# EasyEDA Pro project STC15W4K56S4_2025-01-08_21-36-35.eprj, board PCB1
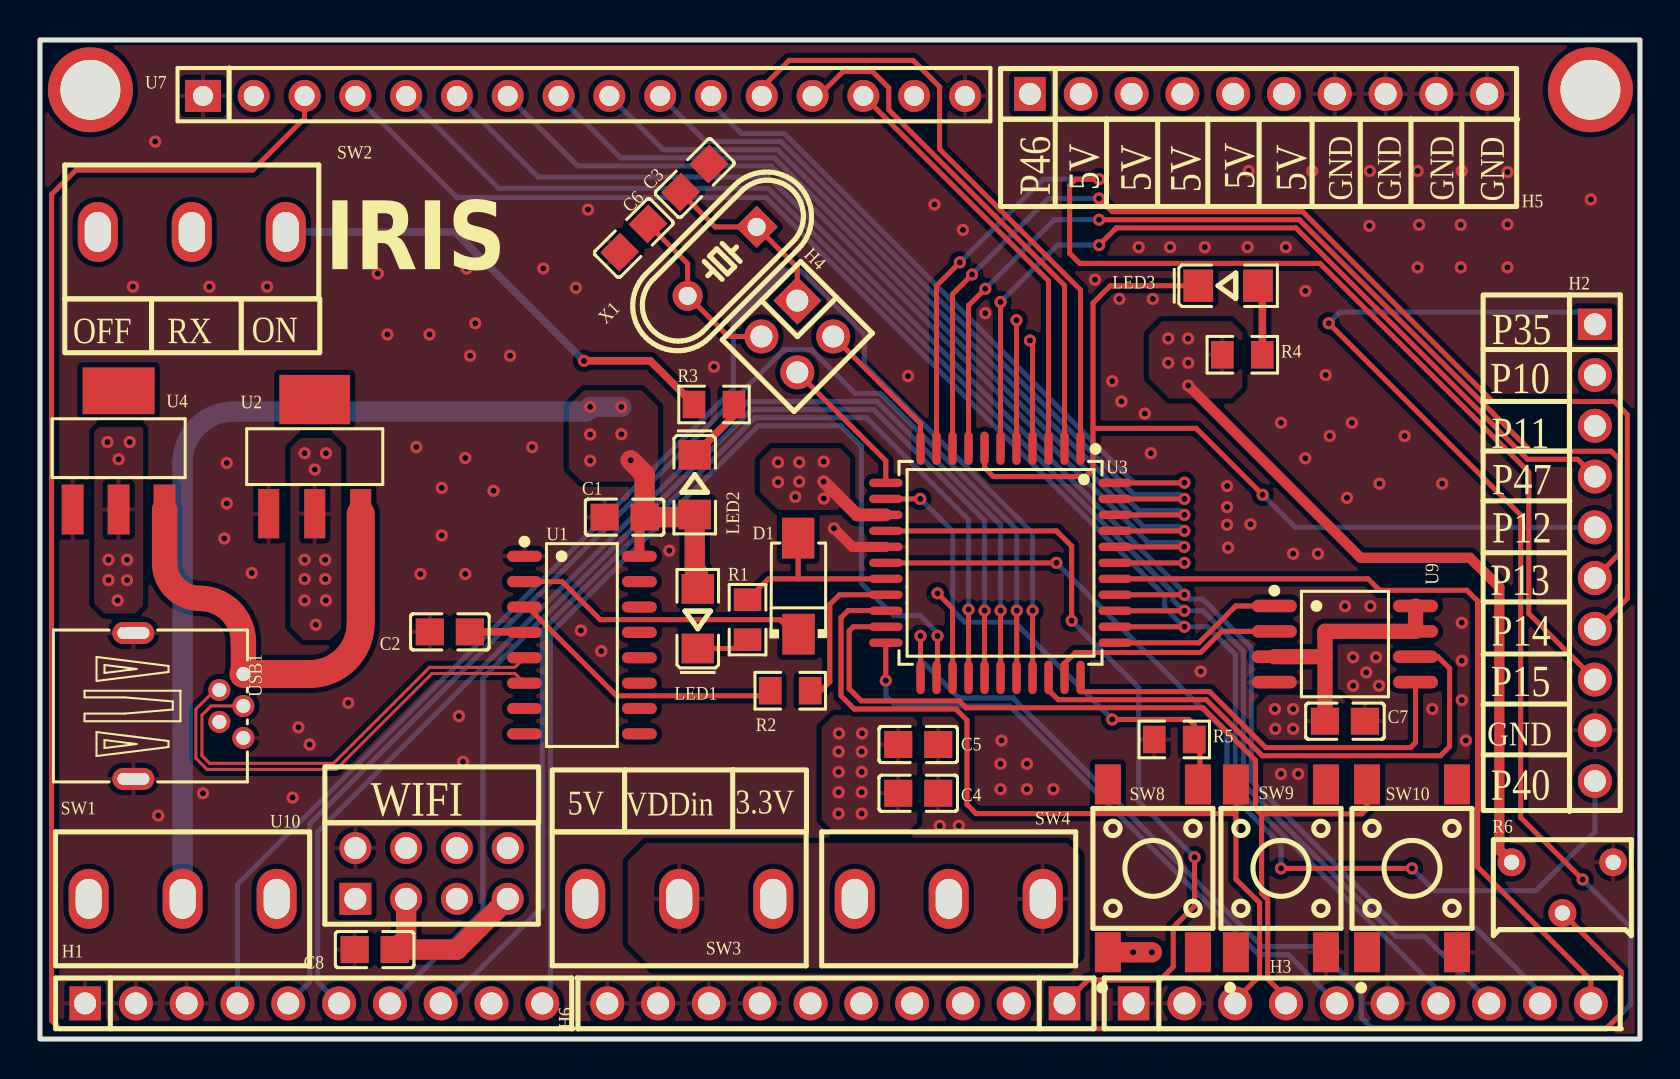
[diagram p2: board, top side]
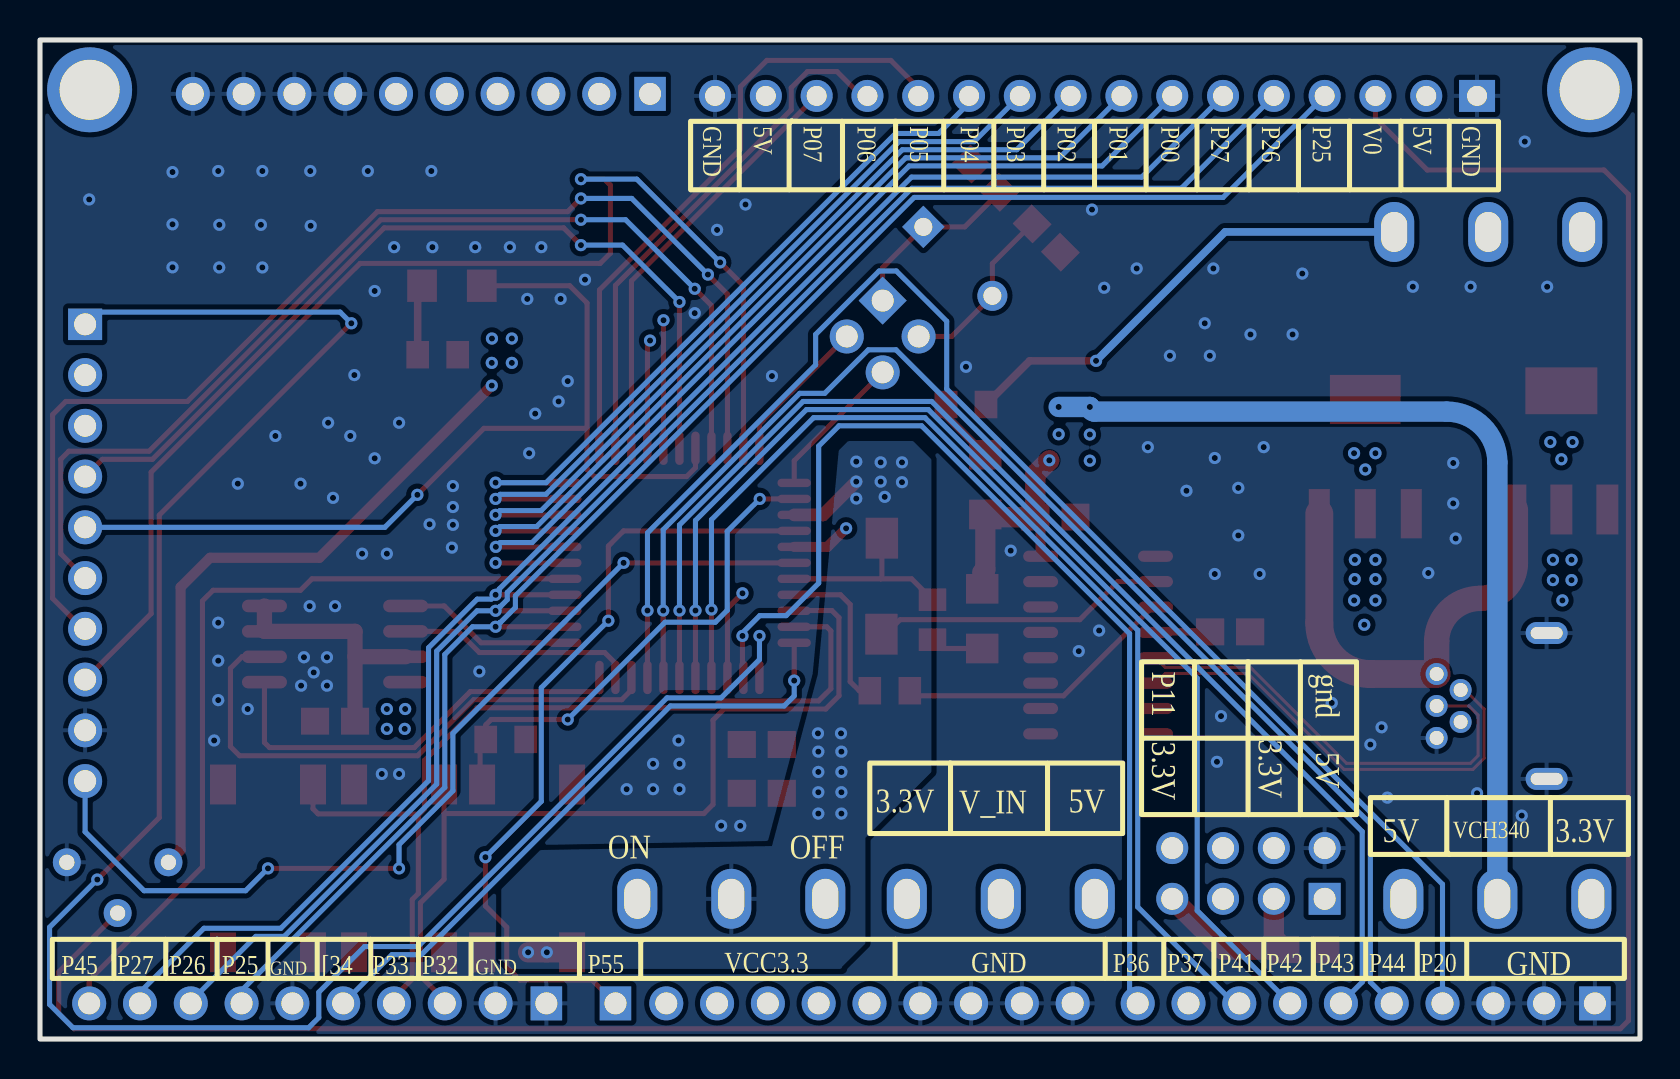
[diagram p3: board, bottom side, seen from below]

Outline 80 x 50 mm; copper layers: Top Layer, 内层2, 内层1, Bottom Layer. Coordinates in mm from the lower left corner of the outline.
Outline path: rectangle 0,50 80,0
Stack: Top Layer 0.035mm 外层铜厚1oz / Dielectric1 0.2104mm 7628 RC49% 8.6mil / 内层2 0.0152mm 内层铜厚 / Dielectric2 1.065mm 1.1mm H/HOZ Copper / 内层1 0.0152mm 内层铜厚 / Dielectric3 0.2104mm 7628 RC49% 8.6mil / Bottom Layer 0.035mm 外层铜厚1oz

## Design rules (mm)
net VCC340: power
net GND: power
net $1N635: signal_power
net VDD: power
net VCC33: power
net VCC5: power
net $1N2603: signal_power
net $1N5908: signal_power
net $1N2614: signal_power
net VCC_IN: power
net VCC: power
template: 自定义配置
spacing copperThickness1oz (default): track to track 0.152, other pairs 0.152 to 0.3
spacing copperThickness2oz: track to track 0.203, other pairs 0.152 to 0.3
track width copperThickness1oz (default): min 0.127, default 0.254, max 2.54
track width copperThickness2oz: min 0.203, default 0.254, max 2.54
track width Power: min 0.508, default 1.016, max 2.54
track width Power_Signal: min 0.254, default 0.381, max 2.54
differential pair differentialPair (default): width min 0.127, default 0.254, max 2.54; gap min 0.152, default 0.152
via viaSize (default): diameter min 0.5, default 0.61, max 10; hole min 0.3, default 0.305, max 6.299
net class power uses Power
net class signal_power uses Power_Signal
net VCC340 uses Power
net GND uses Power
net $1N635 uses Power_Signal
net VDD uses Power
net VCC33 uses Power
net VCC5 uses Power
net $1N2603 uses Power_Signal
net $1N5908 uses Power_Signal
net $1N2614 uses Power_Signal
net VCC_IN uses Power
net VCC uses Power

## Placement (name value [footprint] x y rotation side)
C1  100nF  [C0805]  29.23 26.12 0 top
C2  10nF  [C0805]  20.49 20.38 0 top
C3  30pF  [C0805]  32.74 43.08 225 top
C4  47uF  [C0805]  43.91 12.3 180 top
C5  10nF  [C0805]  43.91 14.74 180 top
C6  30pF  [C0805]  29.69 40.09 225 top
C7  100nF  [C0805]  65.25 15.91 0 top
C8  100nF  [C0805]  16.73 4.48 0 top
D1  SS12  [SMA_L4.3-W2.6-LS5.0-RD]  37.92 22.66 90 top
H1  2.54-1*10  [HDR-TH_10P-P2.54-V-M]  13.69 1.78 0 top
H2  2.54-1*10  [HDR-TH_10P-P2.54-V-M]  77.74 24.34 270 top
H3  2.54-1*10  [HDR-TH_10P-P2.54-V-M]  66.11 1.78 0 top
H4  PZ254V-12-4P  [HDR-TH_4P-P2.54-V-M-R2-C2-S2.54]  37.87 35.16 225 top
H5  2.54-1*10  [HDR-TH_10P-P2.54-V-M]  60.93 47.3 0 top
H6  2.54-1*10  [HDR-TH_10P-P2.54-V-M]  39.8 1.78 180 top
LED1  XL-3216SURC  [LED1206-R-RD_RED]  32.89 21.04 90 top
LED2  XL-3216SURC  [LED1206-R-RD_RED]  32.74 27.74 270 top
LED3  XL-3216SURC  [LED1206-R-RD_RED]  59.41 37.7 0 top
NOREF  -  [Pad_e58]  2.52 47.51 0 top
NOREF#2  -  [Pad_e60]  77.52 47.51 0 top
R1  10kΩ  [R0805]  35.38 20.99 270 top
R2  300Ω  [R0805]  37.51 17.43 180 top
R3  10K  [R0805]  33.7 31.76 0 top
R4  10kΩ  [R0805]  60.12 34.25 180 top
R5  4.7kΩ  [R0805]  56.71 14.99 0 top
R6  10kΩ  [RES-ADJ-TH_3P-L7.1-W6.9-P2.50-BL-BS]  76.12 7.58 0 top
SW1  SS-12D10L5  [SW-TH_SS-12D10L5]  7.13 7.02 0 top
SW2  SS-12D10L5  [SW-TH_SS-12D10L5]  7.59 40.39 180 top
SW3  SS-12D10L5  [SW-TH_SS-12D10L5]  31.96 7.02 0 top
SW4  SS-12D10L5  [SW-TH_SS-12D10L5]  45.44 7.02 0 top
SW8  KH-6X6X6H-STM  [SW-SMD_4P-L6.0-W6.0-P4.50-LS9.0-3]  55.65 8.54 90 top
SW9  KH-6X6X6H-STM  [SW-SMD_4P-L6.0-W6.0-P4.50-LS9.0-3]  62.05 8.54 90 top
SW10  KH-6X6X6H-STM  [SW-SMD_4P-L6.0-W6.0-P4.50-LS9.0-3]  68.6 8.54 90 top
U1  CH340C  [SOP-16_L10.0-W3.9-P1.27-LS6.0-BL]  27.1 19.72 270 top
U2  AMS1117-5.0  [SOT-223_L6.5-W3.5-P2.30-LS7.0-BR]  13.74 29.15 270 top
U3  STC15W4K56S4-30I-LQFP44  [LQFP-44_L10.0-W10.0-P0.80-LS12.0-BL]  48.03 23.83 180 top
U4  AMS1117-3.3  [SOT-223-3_L6.5-W3.4-P2.30-LS7.0-BR]  3.93 29.47 270 top
U7  PM254-1-16-Z-8.5  [HDR-TH_16P-P2.54-V-F-A]  27.2 47.2 0 top
U9  W25Q64JVSSIQ  [SOIC-8_L5.3-W5.3-P1.27-LS8.0-BL]  65.25 19.77 270 top
U10  2.54-2*4  [HDR-TH_8P-P2.54-V-F-R2-C4-S2.54]  19.58 8.29 0 top
USB1  U-M-M5DW-W-1  [MINI-USB-TH_U-M-M5DW-W-1]  7.42 16.67 270 top
X1  24MHz  [HC-49US_L11.5-W4.5-P4.88]  34.11 38.92 225 top

## Footprints (pads in the part's own frame, mm; a bottom-side part is the same pattern mirrored in y, then rotated)
C0805
  rect 1.41x1.35 smd: 1(-1,0) 2(1,0)
HC-49US_L11.5-W4.5-P4.88
  rect 1.5x1.5 hole 0.9: 1(-2.44,0)
  round 1.5 hole 0.9: 2(2.44,0)
HDR-TH_4P-P2.54-V-M-R2-C2-S2.54
  rect 1.7x1.7 hole 1.1: 1(-1.27,-1.27)
  round 1.7 hole 1.1: 2(-1.27,1.27) 3(1.27,-1.27) 4(1.27,1.27)
HDR-TH_8P-P2.54-V-F-R2-C4-S2.54
  rect 1.6x1.6 hole 1.1: 1(-3.81,-1.27)
  round 1.6 hole 1.1: 2(-3.81,1.27) 3(-1.27,-1.27) 4(-1.27,1.27) 5(1.27,-1.27) 6(1.27,1.27) 7(3.81,-1.27) 8(3.81,1.27)
HDR-TH_10P-P2.54-V-M
  rect 1.575x1.7 hole 1.1: 1(-11.43,0)
  round 1.7 hole 1.1: 2(-8.89,0) 3(-6.35,0) 4(-3.81,0) 5(-1.27,0) 6(1.27,0) 7(3.81,0) 8(6.35,0) 9(8.89,0) 10(11.43,0)
HDR-TH_16P-P2.54-V-F-A
  rect 1.8x1.6 hole 1: 1(-19.05,0)
  round 1.6 hole 1: 2(-16.51,0) 3(-13.97,0) 4(-11.43,0) 5(-8.89,0) 6(-6.35,0) 7(-3.81,0) 8(-1.27,0) 9(1.27,0) 10(3.81,0) 11(6.35,0) 12(8.89,0) 13(11.43,0) 14(13.97,0) 15(16.51,0) 16(19.05,0)
LED1206-R-RD_RED
  rect 1.485x1.62 smd: 1(1.492,0) 2(-1.492,0)
LQFP-44_L10.0-W10.0-P0.80-LS12.0-BL
  oval 0.42x1.67 smd: 1(-4,-5.735) 2(-3.2,-5.735) 3(-2.4,-5.735) 4(-1.6,-5.735) 5(-0.8,-5.735) 6(0,-5.735) 7(0.8,-5.735) 8(1.6,-5.735) 9(2.4,-5.735) 10(3.2,-5.735) 11(4,-5.735) 23(4,5.735) 24(3.2,5.735) 25(2.4,5.735) 26(1.6,5.735) 27(0.8,5.735) 28(0,5.735) 29(-0.8,5.735) 30(-1.6,5.735) 31(-2.4,5.735) 32(-3.2,5.735) 33(-4,5.735)
  oval 1.67x0.42 smd: 12(5.735,-4) 13(5.735,-3.2) 14(5.735,-2.4) 15(5.735,-1.6) 16(5.735,-0.8) 17(5.735,0) 18(5.735,0.8) 19(5.735,1.6) 20(5.735,2.4) 21(5.735,3.2) 22(5.735,4) 34(-5.735,4) 35(-5.735,3.2) 36(-5.735,2.4) 37(-5.735,1.6) 38(-5.735,0.8) 39(-5.735,0) 40(-5.735,-0.8) 41(-5.735,-1.6) 42(-5.735,-2.4) 43(-5.735,-3.2) 44(-5.735,-4)
MINI-USB-TH_U-M-M5DW-W-1
  round 1.1 hole 0.7: 1(-1.6,2.75) 2(-0.8,1.55) 3(0,2.75) 4(0.8,1.55) 5(1.6,2.75)
  oval 1.1x2.1 hole 0.6x1.6: 6(-3.65,-2.75) 7(3.65,-2.75)
Pad_e58
  round 4.25 hole 3: 1(0,0)
Pad_e60
  round 4.25 hole 3: 1(0,0)
R0805
  rect 1.133x1.377 smd: 1(-1,0) 2(1,0)
RES-ADJ-TH_3P-L7.1-W6.9-P2.50-BL-BS
  round 1.4 hole 0.762: 1(2.54,1.27) 2(0,-1.27) 3(-2.54,1.27)
SMA_L4.3-W2.6-LS5.0-RD
  rect 2.046x1.62 smd: 1(-2.404,-0.009) 2(2.404,0.009)
SOIC-8_L5.3-W5.3-P1.27-LS8.0-BL
  oval 0.63x2.25 smd: 1(-1.905,-3.53) 2(-0.635,-3.53) 3(0.635,-3.53) 4(1.905,-3.53) 5(1.905,3.53) 6(0.635,3.53) 7(-0.635,3.53) 8(-1.905,3.53)
SOP-16_L10.0-W3.9-P1.27-LS6.0-BL
  oval 0.56x1.745 smd: 1(-4.445,-2.873) 2(-3.175,-2.873) 3(-1.905,-2.873) 4(-0.635,-2.873) 5(0.635,-2.873) 6(1.905,-2.873) 7(3.175,-2.873) 8(4.445,-2.873) 9(4.445,2.873) 10(3.175,2.873) 11(1.905,2.873) 12(0.635,2.873) 13(-0.635,2.873) 14(-1.905,2.873) 15(-3.175,2.873) 16(-4.445,2.873)
SOT-223-3_L6.5-W3.4-P2.30-LS7.0-BR
  rect 2.5x1.1 smd: 1(2.97,-2.3) 2(2.97,0) 3(2.97,2.3)
  rect 2.34x3.6 smd: 4(-2.97,0)
SOT-223_L6.5-W3.5-P2.30-LS7.0-BR
  rect 2.465x1.05 smd: 1(2.857,-2.3) 2(2.857,0) 3(2.857,2.3)
  rect 2.465x3.54 smd: 4(-2.857,0)
SW-SMD_4P-L6.0-W6.0-P4.50-LS9.0-3
  rect 2x1.3 smd: 1(-4.2,2.25) 2(4.2,2.25) 3(-4.2,-2.25) 4(4.2,-2.25)
SW-TH_SS-12D10L5
  oval 2x3 hole 1.3x2: 1(-4.7,0) 2(0,0) 3(4.7,0)

## Nets
As in the schematic.

Pads without a net: NOREF 1; NOREF#2 1; SW2 3; SW4 1; SW8 2 3; SW9 1 4; SW10 1 4; U1 7 8 9 10 11 12 13 14 15; U2 4; U4 4; U10 4 5 6; USB1 4

## Via types
v1: diameter 0.61, hole 0.305, Top Layer to Bottom Layer, 201 vias

## Routing (per net, layer and track width the routed paths; a pad name or vN(x,y) marks a point on that pad's centre or on a via; arc(x,y) is an arc through that point)
GND: length 3
  Top Layer w0.508: 42.29,24.63 40.62,24.63 v1(39.7,25.56)
  vias: v1(4.64,37.65) v1(5.76,44.91) v1(5.91,11.18) v1(8.15,12.3) v1(8.47,37.65) v1(9.22,25.05) v1(9.34,28.83) v1(9.34,26.81) v1(10.59,23.32) v1(11.36,37.65) v1(12.63,12.08) v1(12.92,15.6) v1(13.48,14.74) v1(15.41,16.82) v1(16.89,38.31) v1(17.37,35.26) v1(18.82,29.62) v1(19.02,23.27) v1(19.48,35.26) v1(20.09,27.58) v1(20.09,25.2) v1(20.95,16.16) v1(21.15,13.87) v1(21.26,29.08) v1(21.26,23.27) v1(21.33,38.56) v1(21.51,34.19) v1(21.76,35.82) v1(22.68,27.44) v1(23.5,34.19) v1(24.61,29.62) v1(25.17,38.56) v1(26.79,37.6) v1(27.04,20.44) v1(27.4,41.51) v1(28.06,19.41) v1(31.47,24.44) v1(33.7,33.64) v1(43.4,33.18) v1(44.72,41.76) v1(44.99,10.67) v1(45.94,10.67) v1(46.15,40.49) v1(47.26,36.33) v1(48.03,13.77) v1(48.03,12.5) v1(48.08,14.94) v1(49.35,13.77) v1(49.35,12.5) v1(50.67,12.5) v1(52.75,38) v1(53.61,32.92) v1(53.97,37.04) v1(54.07,31.91) v1(54.94,39.63) v1(55.24,31.3) v1(55.54,29.32) v1(55.64,37.04) v1(56.51,39.63) v1(58.03,18.4) v1(58.24,39.63) v1(59.35,27.67) v1(59.35,26.63) v1(59.35,25.73) v1(59.41,24.59) v1(60.43,43.44) v1(60.38,39.63) v1(60.52,25.76) v1(62.05,30.84) v1(62.05,13.27) v1(62.29,39.63) v1(62.66,24.29) v1(62.91,13.27) v1(63.27,37.44) v1(63.27,29.06) v1(63.61,43.44) v1(63.9,24.29) v1(64.28,33.23) v1(64.49,30.18) v1(65.25,21.66) v1(65.35,27.08) v1(65.59,30.84) v1(65.65,19.11) v1(65.65,17.68) v1(66.31,18.35) v1(66.47,40.7) v1(66.49,43.44) v1(66.52,21.66) v1(66.8,19.11) v1(66.95,17.68) v1(66.97,27.79) v1(68.23,30.18) v1(68.88,43.44) v1(68.96,40.75) v1(68.88,38.61) v1(69.62,16.52) v1(70.11,27.79) v1(71.03,40.75) v1(71.04,38.61) v1(71.09,43.44) v1(71.09,20.83) v1(71.09,18.93) v1(71.09,16.96) v1(71.29,14.94) v1(73.38,43.39) v1(73.38,40.77) v1(73.38,38.62) v1(77.54,42.02)
V0: length 141.9
  Top Layer w0.254: R6.2 79.07,3.36 79.07,1.28 78.3,0.51 0.99,0.51 0.58,0.92 0.58,42.27 1.8,43.49 10.64,43.49 13.23,46.08 U7.3
VCC: length 23.3
  Top Layer w1.27: U4.3 6.23,23.82 arc(6.75,22.57) 8,22.05 arc(9.53,21.42) 10.17,19.88 USB1.1
  Top Layer w1.397: USB1.1 13.5,18.27 arc(15.29,19.01) 16.04,20.81 U2.3
VCC5: length 33.8
  Top Layer w0.508: v1(57.41,32.7) 66.03,24.09 71.5,24.09 72.97,22.61 72.97,9.46 R6.3
  vias: v1(13.23,29.32) v1(13.23,23.98) v1(13.23,23.02) v1(13.23,21.95) v1(13.74,28.5) v1(13.79,20.73) v1(14.26,23.98) v1(14.27,23.02) v1(14.3,29.32) v1(14.29,21.95) v1(56.41,35.06) v1(56.41,33.84) v1(57.4,35.06) v1(57.41,33.84)
VCC33: length 22.3
  Top Layer w0.762: C7.1 64.25,19.13 ; 64.25,19.13 U9.3 ; 64.25,19.13 64.25,20.4 68.78,20.4 68.78,21.67
  Top Layer w1.016: U10.3 18.31,5.05 C8.2 20.85,4.48 U10.7
  vias: v1(3.37,29.88) v1(3.42,23.98) v1(3.42,22.97) v1(3.93,29.01) v1(3.88,21.95) v1(4.35,23.98) v1(4.35,22.97) v1(4.48,29.88) v1(61.74,16.52) v1(61.77,15.52) v1(62.66,16.52) v1(62.66,15.52)
VCC340: length 56.1
  Top Layer w0.508: U1.16 29.97,25.86 C1.2
  Top Layer w1.016: 32.89,23.34 32.74,23.5 LED2.1 32.6,26.12 C1.2 30.23,28.27 v1(29.54,28.96)
  Bottom Layer w1.016: SW1.2 7.13,28.86 arc(7.88,30.66) 9.67,31.4 27.28,31.4 arc(27.44,31.47) v1(27.51,31.63) v1(29.07,31.63)
  vias: v1(27.51,30.25) v1(27.51,28.94) v1(29.07,30.27)
VDD: length 6
  Top Layer w0.635: v1(39.19,27.9) 40.85,26.23 42.29,26.23
  Top Layer w1.016: SW8.1 v1(54.66,4.34) v1(55.6,4.34)
  vias: v1(36.9,28.86) v1(36.9,27.87) v1(37.76,27.13) v1(37.97,28.86) v1(37.97,27.9) v1(39.19,28.9) v1(39.19,27.05) v1(39.95,15.3) v1(39.93,14.38) v1(39.93,13.37) v1(39.93,12.35) v1(39.93,11.28) v1(41.1,15.3) v1(41.09,14.38) v1(41.09,13.37) v1(41.09,12.35) v1(41.09,11.28)
D+: length 22.8
  Top Layer w0.152: USB1.3 8.55,16.67 8.1,16.21 8.1,14.18 8.48,13.8 14.68,13.8 19.48,18.6 23.74,18.6 U1.5
D-: length 22.9
  Top Layer w0.152: U1.6 23.74,18.29 19.6,18.29 14.8,13.49 8.35,13.49 7.79,14.05 7.79,16.51 8.75,17.47 USB1.2
P00: length 46.6
  Top Layer w0.254: 53.76,24.63 v1(57.21,24.63)
  Bottom Layer w0.254: v1(57.21,24.63) 56.99,24.85 55.39,24.85 36.55,43.69 26.89,43.69 U7.7
P01: length 43.8
  Top Layer w0.254: U3.41 v1(57.22,25.43)
  Bottom Layer w0.254: v1(57.22,25.43) 57.01,25.65 55.17,25.65 36.71,44.1 29.03,44.1 U7.8
P02: length 40.9
  Top Layer w0.254: 53.76,26.23 v1(57.22,26.23)
  Bottom Layer w0.254: v1(57.22,26.23) 57.01,26.45 54.94,26.45 36.88,44.51 31.16,44.51 U7.9
P03: length 38
  Top Layer w0.254: U3.43 v1(57.22,27.03)
  Bottom Layer w0.254: v1(57.22,27.03) 56.99,27.26 54.7,27.26 37.05,44.91 33.29,44.91 U7.10
P04: length 35.4
  Top Layer w0.254: U3.44 57.21,27.83 v1(57.22,27.84)
  Bottom Layer w0.254: U7.11 33.55,46.84 35.07,45.32 37.22,45.32 54.69,27.84 v1(57.22,27.84)
P05: length 31.4
  Top Layer w0.254: U7.12 36.09,47.61 37.46,48.98 43.66,48.98 44.98,47.66 44.98,44.54 52.03,37.49 U3.1
P06: length 26.3
  Top Layer w0.254: U7.13 38.93,47.2 40.15,48.42 41.63,48.42 42.44,47.61 42.44,46.5 51.23,37.72 U3.2
P07: length 21.5
  Top Layer w0.254: U3.3 50.43,37.94 U7.14
P10: length 81.6
  Top Layer w0.254: v1(49.5,34.96) 49.63,34.83 U3.4
  内层2 w0.254: U10.1 16.99,8.24 24.39,8.24 48.84,32.68 48.84,34.3 v1(49.5,34.96) 53.36,34.96 56.26,32.06 76.58,32.06 H2.2
P11: length 79.4
  Top Layer w0.254: U3.5 v1(48.83,35.97)
  内层2 w0.254: U10.8 25.14,9.56 48.03,32.45 48.03,35.17 v1(48.83,35.97) 61.79,35.97 63.42,34.35 77.26,34.35 77.28,34.36 78.21,34.36 78.22,34.35 78.56,34.35 79.27,33.64 79.27,32.21 H2.3
P12: length 47.8
  Top Layer w0.254: LED3.2 53.51,37.7 52.65,36.84 52.65,30.56 ; U3.7 47.23,28.59 47.67,28.15 52.29,28.15 52.65,28.51 52.65,30.56 ; 52.65,30.56 57.8,30.56 v1(61.13,27.24)
  Bottom Layer w0.254: v1(61.13,27.24) 62.76,25.61 H2.5
P13: length 52.8
  Top Layer w0.254: v1(47.26,37.55) 46.43,36.71 U3.8 ; H2.6 78.96,24.29 78.96,29.01 78.56,29.42 74.54,29.42 62.96,41 v1(52.95,41)
  Bottom Layer w0.254: 52.85,41 50.72,41 v1(47.26,37.55)
P14: length 59.4
  Top Layer w0.254: H2.7 77.85,20.53 79.37,22.05 79.37,31.25 78.71,31.91 72.63,31.91 63.13,41.41 53.61,41.41 v1(52.95,42.07) ; U3.9 45.63,37.28 v1(46.6,38.26)
  Bottom Layer w0.254: v1(46.6,38.26) 50.41,42.07 v1(52.95,42.07)
P15: length 62.7
  Top Layer w0.254: H2.8 74.44,21.29 74.44,28.37 64,38.82 51.99,38.82 51.48,39.33 51.48,42.73 51.79,43.03 v1(52.95,43.03) ; v1(45.99,38.87) 44.83,37.7 U3.10
  Bottom Layer w0.254: v1(45.99,38.87) 50.16,43.03 v1(52.95,43.03)
P16: length 7.4
  Top Layer w0.254: H4.2 44.03,30.8 U3.11
P17: length 7.4
  Top Layer w0.254: H4.4 42.29,28.94 U3.12
P20: length 74
  Top Layer w0.254: U3.30 v1(49.63,21.44)
  Bottom Layer w0.254: v1(49.63,21.44) 49.63,25.33 41.22,33.74 41.22,35.26 38.04,38.44 37.18,38.44 34.67,35.92 34.67,32.53 9.88,7.74 H1.4
P21: length 28.1
  Top Layer w0.254: 68.78,19.13 69.9,19.13 70.48,18.55 70.48,14.64 70.02,14.18 61.12,14.18 58.31,16.98 50.91,16.98 50.43,17.47 U3.31
P22: length 11.9
  Top Layer w0.254: U3.32 51.23,18.8 51.77,19.34 58.03,19.34 59.09,20.4 U9.2
P23: length 21.7
  Top Layer w0.254: 68.78,17.86 68.78,14.84 68.52,14.59 61.29,14.59 58.48,17.39 52.03,17.39 U3.33
P24: length 8.7
  Top Layer w0.254: U9.1 59.79,21.67 57.95,19.83 U3.34
P25: length 81
  Top Layer w0.254: 53.76,20.63 v1(57.22,20.63)
  Bottom Layer w0.254: U7.4 20.85,42.12 36.29,42.12 56.23,22.18 56.23,21.6 56.98,20.85 57.01,20.85 v1(57.22,20.63) 58.37,20.63 59.76,19.24 59.76,12.59 69.92,2.43 H3.7
P26: length 80.6
  Top Layer w0.254: U3.36 v1(57.22,21.43)
  Bottom Layer w0.254: H3.8 72.46,1.89 69.21,5.14 67.79,5.14 60.17,12.76 60.17,19.41 58.15,21.43 v1(57.22,21.43) 57.01,21.65 56.98,21.65 56.64,21.99 56.64,22.35 36.41,42.58 22.93,42.58 U7.5
P27: length 80.7
  Top Layer w0.254: U3.37 v1(57.22,22.23)
  Bottom Layer w0.254: H3.9 75,2.34 71.8,5.54 67.96,5.54 60.57,12.93 60.57,19.58 58.14,22.02 57.44,22.02 v1(57.22,22.23) 57.04,22.41 57.04,22.52 36.43,43.14 24.91,43.14 U7.6
P30: length 9.2
  Top Layer w0.254: U3.18 37.96,23.03 ; 37.96,23.03 36.42,23.03 R1.1 ; 37.96,23.03 37.91,23.08 37.91,24.91
P31: length 8
  Top Layer w0.254: U3.19 39.97,22.23 39.49,21.75 39.49,17.89 39.03,17.43 R2.1
P32: length 42.9
  Top Layer w0.254: 59.8,11.32 59.76,11.28 46.81,11.28 46.35,11.74 46.35,15.96 45.79,16.52 40.71,16.52 40.05,17.18 40.05,21.09 40.41,21.44 42.28,21.44 U3.20 ; 59.8,11.32 SW9.2 ; 59.8,11.32 59.8,8 60.98,6.81 60.98,3.16 59.76,1.94 H3.3
P33: length 46.1
  Top Layer w0.254: 61.03,11.27 66.1,11.27 66.35,11.52 SW10.2 ; 61.03,11.27 60.78,11.52 60.78,13.94 58.15,16.58 46.31,16.58 45.96,16.92 41.07,16.92 40.46,17.53 40.46,20.43 40.66,20.63 42.29,20.63 ; 61.03,11.27 61.08,11.22 61.08,7.29 61.39,6.98 61.39,3 62.3,2.09 H3.4
P34: length 31.6
  Top Layer w0.254: v1(42.29,17.94) U3.22
  Bottom Layer w0.254: H3.5 62.4,4.22 60.93,4.22 48.48,16.67 42.79,16.67 42.29,17.17 v1(42.29,17.94)
P35: length 101.7
  Top Layer w0.254: v1(77.13,7.98) 74.04,11.08 74.04,26.22 v1(64.44,35.82) ; U3.23 v1(44.03,20.17)
  Bottom Layer w0.254: v1(44.03,20.17) 44.03,18.99 45.94,17.08 48.65,17.08 61.1,4.63 63.77,4.63 66.06,2.34 66.06,1.07 66.57,0.57 78.35,0.57 79.52,1.73 79.52,5.59 v1(77.13,7.98) ; v1(64.44,35.82) 64.99,36.38 77.13,36.38 H2.1
P36: length 52.9
  Top Layer w0.254: U3.24 44.88,18.15 v1(44.88,20.17)
  Bottom Layer w0.254: H1.10 25.52,2.19 25.52,20.29 35.92,30.69 40.05,30.69 41.07,29.67 41.07,22.82 42.69,21.19 44.01,21.19 44.88,20.33 v1(44.88,20.17)
P37: length 37.7
  Top Layer w0.254: v1(44.88,22.31) 45.63,21.56 U3.25
  内层2 w0.254: v1(44.88,22.31) 39.04,22.31 25.03,8.3 25.03,4.24 H1.9
P40: length 48.4
  Top Layer w0.254: v1(62.05,8.54) v1(68.6,8.54) ; v1(50.82,23.83) U3.17
  Bottom Layer w0.254: 77.74,12.91 77.74,10.37 74.8,7.42 69.72,7.42 v1(68.6,8.54) ; v1(50.82,23.83) 59.35,15.3 59.35,12.42 62.05,9.73 v1(62.05,8.54)
P41: length 56.7
  Top Layer w0.254: U3.26 v1(46.43,21.49)
  Bottom Layer w0.254: v1(46.43,21.49) 46.43,25.99 41.32,31.1 35.75,31.1 25.12,20.46 25.12,6.61 20.29,1.78 20.04,1.78
P42: length 59
  Top Layer w0.254: U3.27 v1(47.23,21.44)
  Bottom Layer w0.254: H1.7 22.14,6.43 22.14,18.06 35.58,31.5 41.68,31.5 47.23,25.95 v1(47.23,21.44)
P43: length 62.3
  Top Layer w0.254: U3.28 v1(48.03,21.44)
  Bottom Layer w0.254: v1(48.03,21.44) 48.03,25.73 41.84,31.91 35.41,31.91 13.89,10.38 13.89,2.85 H1.6
P44: length 65.7
  Top Layer w0.254: v1(48.84,21.44) 48.84,18.11 U3.29
  Bottom Layer w0.254: v1(48.84,21.44) 48.84,25.49 42.01,32.32 40.76,32.32 38.58,34.49 37.2,34.49 13.48,10.78 13.48,2.85 H1.5
P45: length 41.1
  Top Layer w0.254: 77.54,1.78 77.54,2.95 71.88,8.62 71.88,21.93 71.34,22.46 66.97,22.46 66.4,23.03 U3.38
P46: length 160.2
  Top Layer w0.254: U3.39 v1(57.22,23.83)
  内层2 w0.254: v1(57.22,23.83) 55.95,23.83 48.79,16.67 37.26,16.67 29.54,8.95 29.54,5.7 26.74,2.9 26.74,1.53 25.78,0.57 0.94,0.57 0.58,0.92 0.58,34.25 2.87,36.53 21.25,36.53 27.86,43.14 45.33,43.14 49.5,47.3
P47: length 43.7
  Top Layer w0.254: v1(52.95,39.73) 53.82,40.6 62.79,40.6 74.38,29.01 76.88,29.01 H2.4 ; U3.6 v1(48.03,36.89)
  Bottom Layer w0.254: v1(52.95,39.73) 50.87,39.73 v1(48.03,36.89)
P54: length 25.6
  Top Layer w0.254: v1(53.61,15.99) 57.44,15.99 57.71,15.72 R5.2 58,14.71 58,12.84 SW8.4 ; U3.13 v1(44.01,27.03)
  Bottom Layer w0.254: v1(44.01,27.03) 45.64,25.41 45.64,21.46 46.24,20.86 48.75,20.86 v1(53.61,15.99)
P55: length 39.8
  Top Layer w0.254: H6.1 52.4,2.95 56,2.95 56.66,3.61 56.66,5.59 57.73,6.66 v1(57.73,9.1) ; v1(51.58,20.94) 51.58,24.67 50.82,25.43 U3.15
  Bottom Layer w0.254: v1(57.73,9.1) 54.94,11.89 54.94,17.58 v1(51.58,20.94)
$1N627: length 14.8
  Top Layer w0.254: D1.1 37.72,20.26 37,20.99 28.01,20.99 26.11,22.89 U1.2
$1N631: length 14.2
  Top Layer w0.254: R2.2 36.26,17.18 28.82,17.18 24.38,21.62 U1.3
$1N635: length 2.7
  Top Layer w0.381: C2.2 24.2,20.38 U1.4
$1N889: length 2.7
  Top Layer w0.254: LED1.2 34.94,19.54 R1.2
$1N2603: length 3.3
  Top Layer w0.381: R3.2 34.7,31.2 LED2.2
$1N2614: length 24
  Top Layer w0.381: v1(27.2,33.94) 30.52,33.94 R3.1
  Bottom Layer w0.381: SW2.1 20.75,40.39 v1(27.2,33.94)
$1N2745: length 9.1
  Top Layer w0.254: H4.1 37.87,38.61 X1.1 33.76,40.64 C3.2
$1N2750: length 9
  Top Layer w0.254: C6.1 32.38,38.81 X1.2 34.42,35.16 H4.3
$1N5908: length 3.5
  Top Layer w0.381: R4.1 61.12,37.48 LED3.1

## Copper pours and planes (outline as drawn; the poured copper is in the pictures)
GND on Top Layer: -2.01,51.37 81.1,51.37 81.1,-1.92 -2.01,-1.92
GND on Bottom Layer: -1.66,51.21 81.66,51.21 81.66,-1.47 -1.66,-1.47
GND on 内层2: -1.35,51.21 81.45,51.21 81.45,-1.37 -1.35,-1.37
VCC5 on Top Layer: 55.44,35.26 56.1,35.92 59.56,35.92 60.12,35.36 60.12,32.62 59.56,32.06 56.46,32.06 55.44,33.08
VCC5 on Top Layer: 12.52,29.57 13.03,30.08 14.55,30.08 15.06,29.57 15.06,20.53 14.5,19.97 13.18,19.97 12.52,20.63
VCC5 on 内层1: 0.26,49.74 79.74,49.74 79.74,3.59 0.26,3.59
VCC33 on Top Layer: 60.83,16.67 61.39,17.23 64.95,17.23 65.35,16.82 65.35,14.99 65.1,14.74 61.64,14.74 60.83,15.55
VCC33 on Top Layer: 2.71,30.38 2.97,30.64 5.05,30.64 5.15,30.54 5.15,21.7 4.75,21.29 3.22,21.29 2.71,21.8
VCC33 on 内层1: 0.26,38.33 79.74,38.33 79.74,0.26 0.26,0.26
VCC340 on Top Layer: 30.91,28.51 30.3,27.9 27.1,27.9 26.44,28.56 26.44,31.71 27.2,32.47 30.09,32.47 30.91,31.65
VCC_IN on Top Layer: 29.38,4.78 29.38,8.9 30.3,9.81 51.36,9.81 51.97,9.2 51.97,4.16 51.35,3.54 30.62,3.54
VDD on Top Layer: 35.99,28.96 36.6,29.57 40,29.57 40.51,29.06 40.51,27.13 39.85,26.47 36.9,26.47 35.99,27.39
VDD on Top Layer: 39.09,15.6 39.7,16.21 43.56,16.21 43.86,15.91 43.86,10.84 43.39,10.37 39.7,10.37 39.09,10.98
VDD on Bottom Layer: 38.73,4.78 39.9,3.61 39.9,3.51 56.46,3.51 56.94,3.99 56.94,7.51 54.99,9.46 43.4,9.66 41.11,18.24 40.06,29.46 39.59,29.93 36.34,29.93 35.43,29.01 35.43,13.37 38.73,10.06

Small or netless copper shapes (teardrops, artwork), in the pictures only: 71 on 内层1

## Text on the board
Bottom Silkscreen Layer: GND | VCH340 | P20 | P44 | P43 | P42 | P41 | P37 | P36 | P55 | P32 | P33 | [34 | P25 | P26 | P27 | P45 | 5V | V0 | P00 | P01 | P02 | P03 | P04 | P05 | P06 | P07 | VCC3.3 | 3.3V | gnd | P11 | V_IN | OFF | ON
Top Silkscreen Layer: IRIS | 5V | VDDin | 3.3V | GND | OFF | RX | ON | P10 | P13 | P40 | P15 | P11 | P14 | P35 | P12 | P47 | P46 | WIFI
